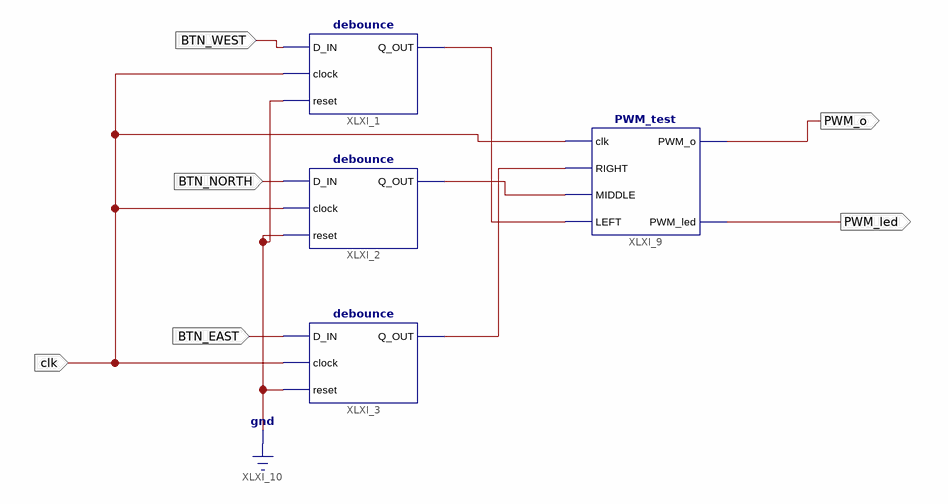
[diagram p0: schematic sheet 1]
// Xilinx ISE schematic Circuito.sch (spartan3e) as structural Verilog: 4 symbols, 6 ports
module Circuito (
  input  BTN_WEST,
  input  BTN_NORTH,
  input  BTN_EAST,
  input  clk,
  output PWM_o,
  output PWM_led
);

  wire XLXN_16, XLXN_17, XLXN_18;

  debounce XLXI_1 (.D_IN(BTN_WEST), .clock(clk), .reset(1'b0), .Q_OUT(XLXN_17));
  debounce XLXI_2 (.D_IN(BTN_NORTH), .clock(clk), .reset(1'b0), .Q_OUT(XLXN_16));
  debounce XLXI_3 (.D_IN(BTN_EAST), .clock(clk), .reset(1'b0), .Q_OUT(XLXN_18));
  PWM_test XLXI_9 (.clk(clk), .RIGHT(XLXN_18), .MIDDLE(XLXN_16), .LEFT(XLXN_17), .PWM_o(PWM_o), .PWM_led(PWM_led));
endmodule
